# Altium schematic sheet opi_link_X_standard.SchDoc
size A4
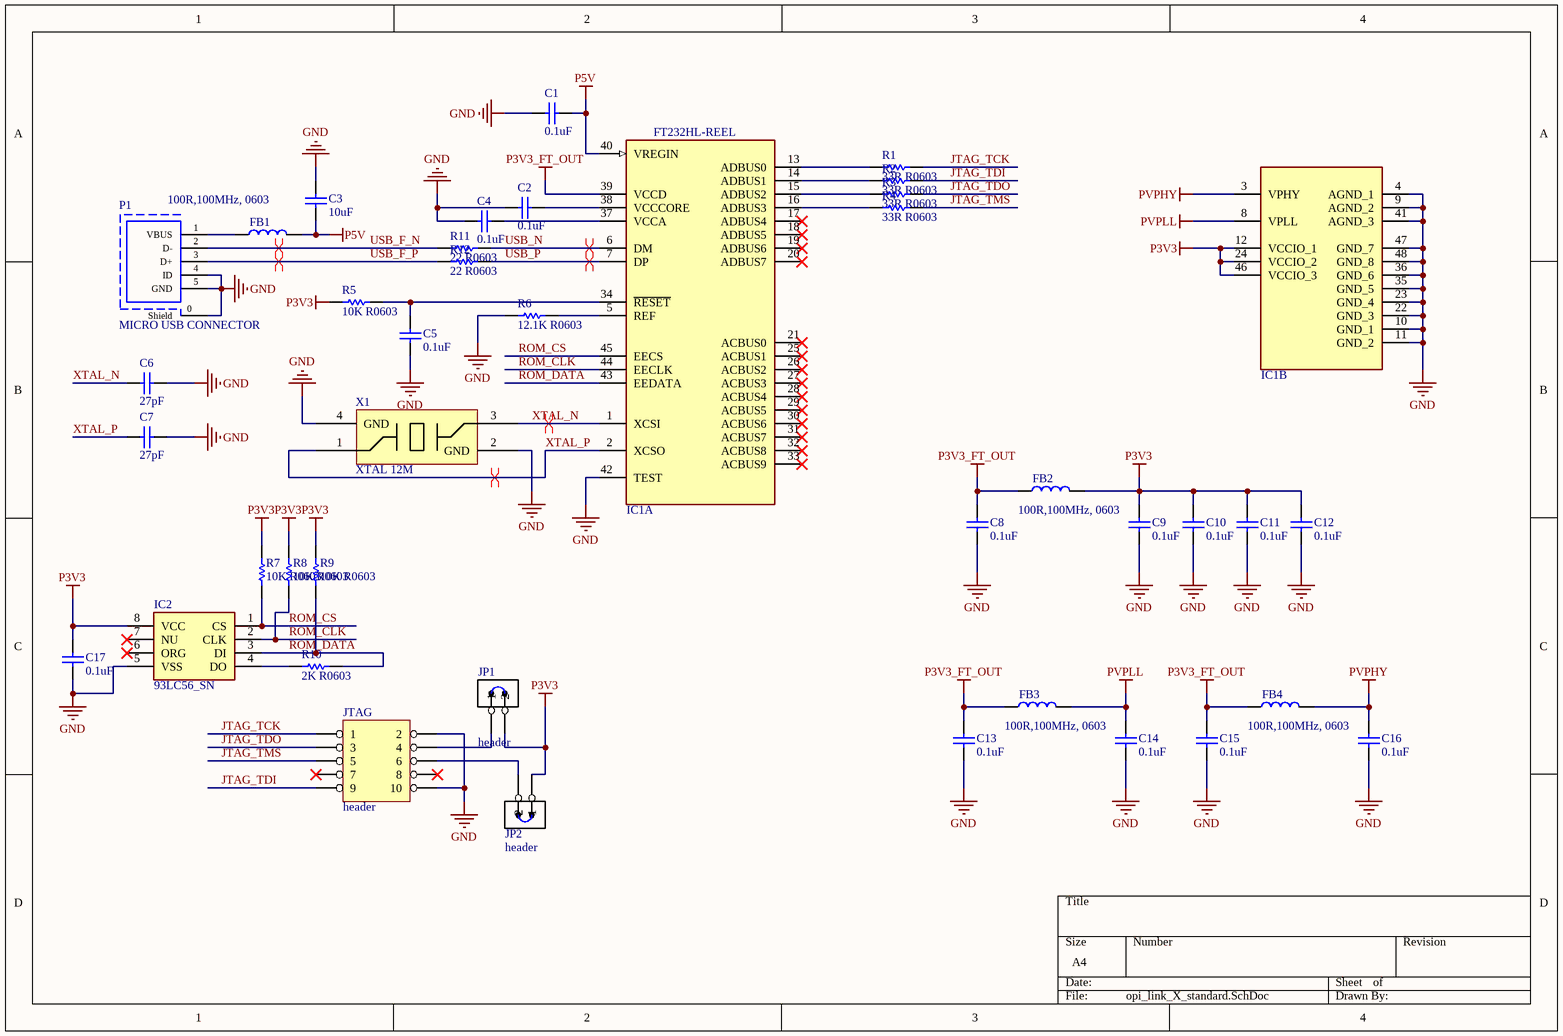
[diagram p0: opi_link_X_standard.SchDoc]

## Parts
C1  0.1uF  [0603_C]
C2  0.1uF  [0603_C]
C3  10uF  [0805_c]
C4  0.1uF  [0603_C]
C5  0.1uF  [0603_C]
C6  27pF  [0603_C]
C7  27pF  [0603_C]
C8  0.1uF  [0603_C]
C9  0.1uF  [0603_C]
C10  0.1uF  [0603_C]
C11  0.1uF  [0603_C]
C12  0.1uF  [0603_C]
C13  0.1uF  [0603_C]
C14  0.1uF  [0603_C]
C15  0.1uF  [0603_C]
C16  0.1uF  [0603_C]
C17  0.1uF  [0603_C]
FB1  100R,100MHz, 0603  [0603]
FB2  100R,100MHz, 0603  [0603]
FB3  100R,100MHz, 0603  [0603]
FB4  100R,100MHz, 0603  [0603]
IC1  FT232HL-REEL  [LQFP48]  (parts A,B of 2)
IC2  93LC56_SN  [SOIC127P600X175-8N]
JP1  header  [jumper]
JP2  header  [jumper]
JTAG  header  [header2X5]
P1  MICRO USB CONNECTOR  [USB_Micro_qian]
R1  33R R0603  [0603_R]
R2  33R R0603  [0603_R]
R3  33R R0603  [0603_R]
R4  33R R0603  [0603_R]
R5  10K R0603  [0603_R]
R6  12.1K R0603  [0603_R]
R7  10K R0603  [0603_R]
R8  10K R0603  [0603_R]
R9  10K R0603  [0603_R]
R10  2K R0603  [0603_R]
R11  22 R0603  [0603_R]
R12  22 R0603  [0603_R]
X1  XTAL 12M  [OSC_KH3225_4P]

## Nets
GND: C1.1 C2.2 C3.2 C4.2 C5.2 C6.2 C7.2 C8.1 C9.1 C10.1 C11.1 C12.1 C13.1 C14.1 C15.1 C16.1 C17.1 IC1.4(AGND_1) IC1.9(AGND_2) IC1.10(GND_1) IC1.11(GND_2) IC1.22(GND_3) IC1.23(GND_4) IC1.35(GND_5) IC1.36(GND_6) IC1.41(AGND_3) IC1.42(TEST) IC1.47(GND_7) IC1.48(GND_8) IC2.5(VSS) JTAG.2 JTAG.10 P1.0(Shield) P1.4(ID) P1.5(GND) R6.1 X1.2(GND) X1.4(GND)
P3V3: C9.2 C10.2 C11.2 C12.2 C17.2 FB2.2 IC1.12(VCCIO_1) IC1.24(VCCIO_2) IC1.46(VCCIO_3) IC2.8(VCC) JP1.2 JP2.1 R5.1 R7.2 R8.2 R9.2
P3V3_FT_OUT: C8.2 C13.2 C15.2 FB2.1 FB3.1 FB4.1 IC1.39(VCCD)
P5V: C1.2 C3.1 FB1.2 IC1.40(VREGIN)
PVPHY: C16.2 FB4.2 IC1.3(VPHY)
PVPLL: C14.2 FB3.2 IC1.8(VPLL)
JTAG_TCK: JTAG.1 R1.2
JTAG_TDI: JTAG.9 R2.2
JTAG_TDO: JTAG.3 R3.2
JTAG_TMS: JTAG.5 R4.2
ROM_CLK: IC1.44(EECLK) IC2.2(CLK) R8.1
ROM_CS: IC1.45(EECS) IC2.1(CS) R7.1
ROM_DATA: IC1.43(EEDATA) IC2.3(DI) R9.1 R10.2
USB_F_N: P1.2(D-) R11.1
USB_F_P: P1.3(D+) R12.1
USB_N: IC1.6(DM) R11.2
USB_P: IC1.7(DP) R12.2
XTAL_N: C6.1 IC1.1(XCSI) X1.3(OSC2)
XTAL_P: C7.1 IC1.2(XCSO) X1.1(OSC1)
NetC2_1: C2.1 IC1.38(VCCCORE)
NetC4_1: C4.1 IC1.37(VCCA)
NetC5_1: C5.1 IC1.34(~{RESET}) R5.2
NetFB1_1: FB1.1 P1.1(VBUS)
NetIC1_5: IC1.5(REF) R6.2
NetIC1_13: IC1.13(ADBUS0) R1.1
NetIC1_14: IC1.14(ADBUS1) R2.1
NetIC1_15: IC1.15(ADBUS2) R3.1
NetIC1_16: IC1.16(ADBUS3) R4.1
NetIC2_4: IC2.4(DO) R10.1
NetJP1_1: JP1.1 JTAG.4
NetJP2_2: JP2.2 JTAG.6

Not connected (* = marked no-connect by the designer): IC1 17(ADBUS4)* 18(ADBUS5)* 19(ADBUS6)* 20(ADBUS7)* 21(ACBUS0)* 25(ACBUS1)* 26(ACBUS2)* 27(ACBUS3)* 28(ACBUS4)* 29(ACBUS5)* 30(ACBUS6)* 31(ACBUS7)* 32(ACBUS8)* 33(ACBUS9)*; IC2 6(ORG)* 7(NU)*; JTAG 7* 8*

## Layout directives
differential pair: USB_F_N, USB_F_P, USB_N, USB_P, XTAL_N, XTAL_P

## Library data of the parts
C1-C17 = CAP: Capacitor; Value: 104; Published: 8-Jun-2000; LatestRevisionDate: 17-Jul-2002; LatestRevisionNote: Re-released for DXP Platform.; PackageReference: RAD-0.3; Publisher: Altium Limited
FB1-FB4 = FB: 磁珠
IC1 = FT232HL-REEL: Integrated Circuit; Manufacturer_Name: FTDI Chip; Datasheet Link: http://www.ftdichip.com/Support/Documents/DataSheets/ICs/DS_FT232H.pdf; Height: 1.6mm; Manufacturer_Part_Number: FT232HL-REEL; Arrow Part Number: FT232HL-REEL; Arrow Price/Stock: https://www.arrow.com/en/products/ft232hl-reel/ftdi-chip; Mouser Part Number: 895-FT232HL-REEL; Mouser Price/Stock: https://www.mouser.co.uk/ProductDetail/FTDI/FT232HL-REEL?qs=rzPzygjq8vIanTFlYsBQCw%3D%3D
IC2 = 93LC56_SN: Integrated Circuit; Manufacturer_Name: Microchip; Manufacturer_Part_Number: 93LC56/SN; Datasheet Link: http://uk.rs-online.com/web/p/products/8195165; Height: 1.75mm; Arrow Part Number: 93LC56/SN; Arrow Price/Stock: https://www.arrow.com/en/products/93lc56sn/microchip-technology; Mouser Part Number: 579-93LC56SN; Mouser Price/Stock: https://www.mouser.com/Search/Refine.aspx?Keyword=579-93LC56SN
JP1 JP2 = HEADER 2
JTAG = HEADER 5X2
P1 = MICRO USB_in
R1-R12 = RES: Resistor; Value: 1K; Published: 8-Jun-2000; Revision: July-2002: Re-released for DXP Platform.; Publisher: Altium Limited
X1 = XTAL_SMT